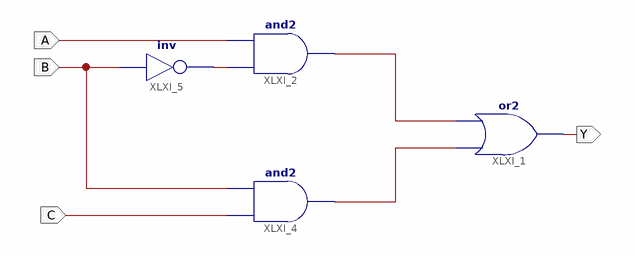
[diagram p0: schematic sheet 1]
// Xilinx ISE schematic Lab_Aschematic.sch (artix7) as structural Verilog: 4 symbols, 4 ports
module Lab_Aschematic (
  input  A,
  input  B,
  input  C,
  output Y
);

  wire XLXN_2, XLXN_3, XLXN_8;

  or XLXI_1 (Y, XLXN_2, XLXN_3);
  and XLXI_2 (XLXN_3, XLXN_8, A);
  and XLXI_4 (XLXN_2, C, B);
  not XLXI_5 (XLXN_8, B);
endmodule
